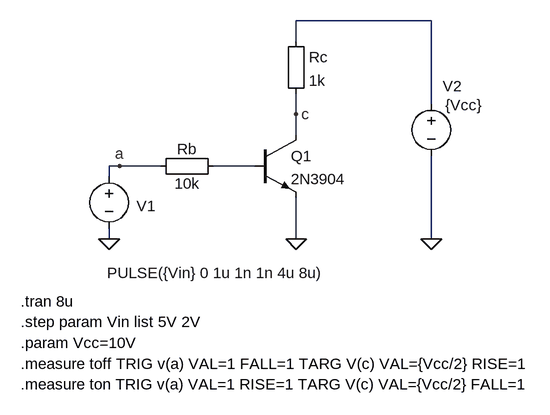
[diagram p0: schematic BT-CE-SWITCH-VIN-3.asc]
BT-CE-SWITCH-VIN-3.asc, the LTspice schematic file:
Version 4
SHEET 1 880 680
WIRE 416 -96 208 -96
WIRE 208 -64 208 -96
WIRE 416 32 416 -96
WIRE 208 48 208 16
WIRE 208 80 208 48
WIRE -64 128 -80 128
WIRE 0 128 -64 128
WIRE 144 128 80 128
WIRE -80 144 -80 128
WIRE -80 240 -80 224
WIRE 208 240 208 176
WIRE 416 240 416 112
FLAG 208 240 0
FLAG -80 240 0
FLAG 416 240 0
FLAG -64 128 a
FLAG 208 48 c
SYMBOL Misc\\EuropeanResistor 192 -80 R0
SYMATTR InstName Rc
SYMATTR Value 1k
SYMBOL Misc\\EuropeanResistor 96 112 R90
WINDOW 0 5 56 VBottom 2
WINDOW 3 27 56 VTop 2
SYMATTR InstName Rb
SYMATTR Value 10k
SYMBOL voltage -80 128 R0
WINDOW 3 -3 164 Left 2
WINDOW 123 0 0 Left 2
WINDOW 39 0 0 Left 2
WINDOW 0 42 61 Left 2
SYMATTR Value PULSE({Vin} 0 1u 1n 1n 4u 8u)
SYMATTR InstName V1
SYMBOL voltage 416 16 R0
WINDOW 3 22 18 Left 2
WINDOW 123 0 0 Left 2
WINDOW 39 0 0 Left 2
WINDOW 0 18 -11 Left 2
SYMATTR Value {Vcc}
SYMATTR InstName V2
SYMBOL npn 144 80 R0
SYMATTR InstName Q1
SYMATTR Value 2N3904
TEXT -216 336 Left 2 !.tran 8u
TEXT -216 368 Left 2 !.step param Vin list 5V 2V
TEXT -216 432 Left 2 !.measure toff TRIG v(a) VAL=1 FALL=1 TARG V(c) VAL={Vcc/2} RISE=1
TEXT -216 400 Left 2 !.param Vcc=10V
TEXT -216 464 Left 2 !.measure ton TRIG v(a) VAL=1 RISE=1 TARG V(c) VAL={Vcc/2} FALL=1

The netlist it stands for:
* BT-CE-SWITCH-VIN-3.asc
Rc N001 c 1k
Rb N002 a 10k
V1 a 0 PULSE({Vin} 0 1u 1n 1n 4u 8u)
V2 N001 0 {Vcc}
Q1 c N002 0 0 2N3904
.model NPN NPN
.model PNP PNP
.lib standard.bjt
.tran 8u
.step param Vin list 5V 2V
.measure toff TRIG v(a) VAL=1 FALL=1 TARG V(c) VAL={Vcc/2} RISE=1
.param Vcc=10V
.measure ton TRIG v(a) VAL=1 RISE=1 TARG V(c) VAL={Vcc/2} FALL=1
.backanno
.end